# Altium schematic sheet Principal.SchDoc
size A4; Author: Thomas Kreppel; CompanyName: Universidad de Santiago de Chile; Address1: Avenida Ecuador Nº 3519; Address2: Estación Central, Santiago; Address3: Chile; DocumentNumber: 1; SheetNumber: 1; SheetTotal: 5
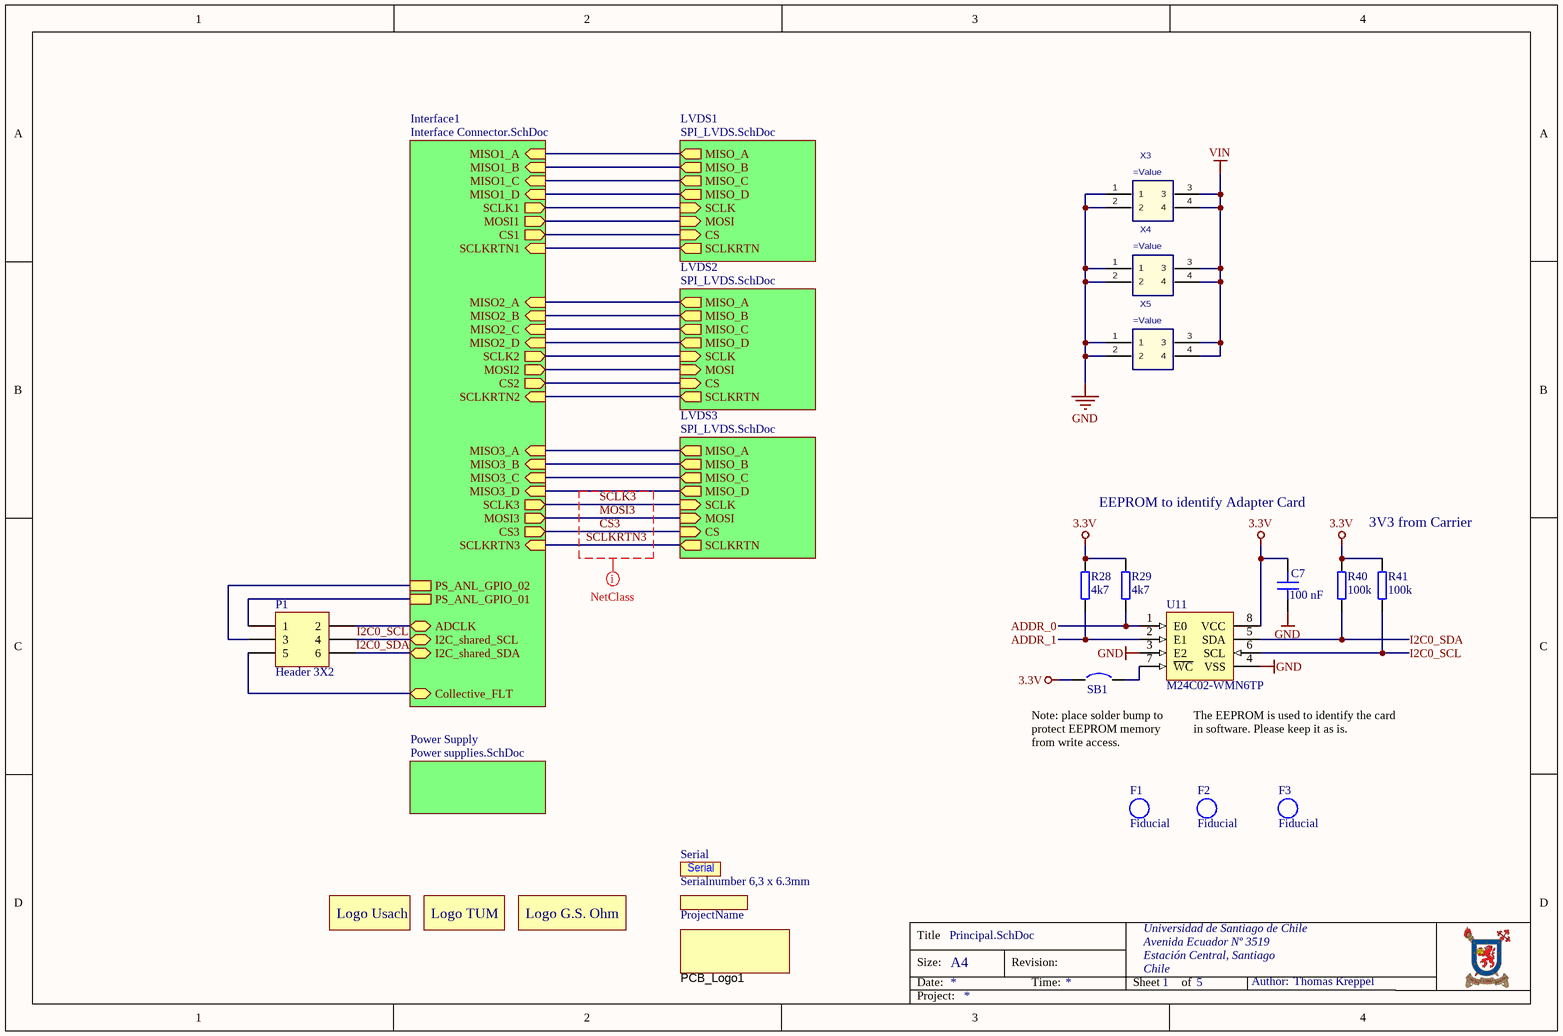
[diagram p0: Principal.SchDoc]

## Parts
C7  100 nF  [C_0603]
F1  Fiducial  [Fiducial_1.7mm]  (no BOM)
F2  Fiducial  [Fiducial_1.7mm]  (no BOM)
F3  Fiducial  [Fiducial_1.7mm]  (no BOM)
Logo1  LOGO USACH  [Logo Usach]  (value not drawn)  (no BOM)
Logo2  LOGO TUM  [Logo TUM]  (value not drawn)  (no BOM)
Logo3  LOGO G.S. Ohm  [Logo G.S.Ohm University]  (value not drawn)  (no BOM)
P1  Header 3X2  [HDR2X3]  (no BOM)
PCB_Logo1  ESD Susceptible  [ESD_Overlay_Medium]  (value not drawn)  (no BOM)
ProjectName  Project Name, Rev  [ID_ProjectRev]  (value not drawn)  (no BOM)
R28  4k7  [RES 0603_1608]
R29  4k7  [RES 0603_1608]
R40  100k  [RES 0603_1608]
R41  100k  [RES 0603_1608]
SB1  Solder Bump 0603  [SB_0603]  (value not drawn)  (no BOM)
Serial  Serialnumber 6,3 x 6.3mm  [Serial_6.3x6.3mm]  (no BOM)
U11  M24C02-WMN6TP  [D0008A_N]
X3  (no value)  [IPL1-102-01-L-D-K]
X4  (no value)  [IPL1-102-01-L-D-K]
X5  (no value)  [IPL1-102-01-L-D-K]

## Sub-sheets
Interface1 = Interface Connector.SchDoc: MISO2_B (in), MOSI3 (out), SCLK1 (out), MISO3_A (in), SCLK2 (out), CS1 (out), MISO1_A (in), MISO1_C (in), MISO2_C (in), PS_ANL_GPIO_02, MOSI1 (out), Collective_FLT (bidir), SCLKRTN2 (in), MOSI2 (out), SCLKRTN3 (in), MISO3_B (in), CS2 (out), SCLKRTN1 (in), ADCLK (bidir), MISO1_D (in), CS3 (out), MISO3_D (in), MISO3_C (in), MISO1_B (in), MISO2_A (in), MISO2_D (in), I2C_shared_SDA (bidir), PS_ANL_GPIO_01, SCLK3 (out), I2C_shared_SCL (bidir)
LVDS1 = SPI_LVDS.SchDoc: SCLKRTN (out), MOSI (in), MISO_C (out), MISO_A (out), MISO_D (out), MISO_B (out), SCLK (in), CS (in)
LVDS2 = SPI_LVDS.SchDoc: SCLKRTN (out), MOSI (in), MISO_C (out), MISO_A (out), MISO_D (out), MISO_B (out), SCLK (in), CS (in)
LVDS3 = SPI_LVDS.SchDoc: SCLKRTN (out), MOSI (in), MISO_C (out), MISO_A (out), MISO_D (out), MISO_B (out), SCLK (in), CS (in)
Power Supply = Power supplies.SchDoc: no entries

## Nets
3.3V: C7.1 R28.2 R29.2 R40.2 R41.2 SB1.1 U11.8(VCC)
GND: C7.2 U11.3(E2) U11.4(VSS) X3.1 X3.2 X4.1 X4.2 X5.1 X5.2
VIN: X3.3 X3.4 X4.3 X4.4 X5.3 X5.4
ADDR_0: R29.1 U11.1(E0)
ADDR_1: R28.1 U11.2(E1)
CS3: sheet Interface1/CS3, sheet LVDS3/CS
I2C0_SCL: P1.4 R41.1 U11.6(SCL) ; sheet Interface1/I2C_shared_SCL
I2C0_SDA: P1.6 R40.1 U11.5(SDA) ; sheet Interface1/I2C_shared_SDA
MOSI3: sheet Interface1/MOSI3, sheet LVDS3/MOSI
SCLK3: sheet Interface1/SCLK3, sheet LVDS3/SCLK
SCLKRTN3: sheet Interface1/SCLKRTN3, sheet LVDS3/SCLKRTN
NetP1_1: P1.1 ; sheet Interface1/PS_ANL_GPIO_01
NetP1_2: P1.2 ; sheet Interface1/ADCLK
NetP1_3: P1.3 ; sheet Interface1/PS_ANL_GPIO_02
NetP1_5: P1.5 ; sheet Interface1/Collective_FLT
NetSB1_2: SB1.2 U11.7(~{WC})
(unnamed): sheet Interface1/MISO2_B, sheet LVDS2/MISO_B
(unnamed): sheet Interface1/SCLK1, sheet LVDS1/SCLK
(unnamed): sheet Interface1/MISO3_A, sheet LVDS3/MISO_A
(unnamed): sheet Interface1/SCLK2, sheet LVDS2/SCLK
(unnamed): sheet Interface1/CS1, sheet LVDS1/CS
(unnamed): sheet Interface1/MISO1_A, sheet LVDS1/MISO_A
(unnamed): sheet Interface1/MISO1_C, sheet LVDS1/MISO_C
(unnamed): sheet Interface1/MISO2_C, sheet LVDS2/MISO_C
(unnamed): sheet Interface1/MOSI1, sheet LVDS1/MOSI
(unnamed): sheet Interface1/SCLKRTN2, sheet LVDS2/SCLKRTN
(unnamed): sheet Interface1/MOSI2, sheet LVDS2/MOSI
(unnamed): sheet Interface1/MISO3_B, sheet LVDS3/MISO_B
(unnamed): sheet Interface1/CS2, sheet LVDS2/CS
(unnamed): sheet Interface1/SCLKRTN1, sheet LVDS1/SCLKRTN
(unnamed): sheet Interface1/MISO1_D, sheet LVDS1/MISO_D
(unnamed): sheet Interface1/MISO3_D, sheet LVDS3/MISO_D
(unnamed): sheet Interface1/MISO3_C, sheet LVDS3/MISO_C
(unnamed): sheet Interface1/MISO1_B, sheet LVDS1/MISO_B
(unnamed): sheet Interface1/MISO2_A, sheet LVDS2/MISO_A
(unnamed): sheet Interface1/MISO2_D, sheet LVDS2/MISO_D

## Layout directives
net class SPI_C: CS3, MOSI3, SCLK3, SCLKRTN3

## Notes on the sheet
- EEPROM to identify Adapter Card
- 3V3 from Carrier
- Note: place solder bump to protect EEPROM memory from write access.
- (near U11) The EEPROM is used to identify the card in software. Please keep it as is.
- Title
- Size:
- Date:
- A4
- Revision:
- Time:
- Sheet
- of
- Author:
- Project:
- (in symbol LOGO G.S. Ohm) Logo G.S. Ohm
- (in symbol LOGO TUM) Logo TUM
- (in symbol LOGO USACH) Logo Usach

## Library data of the parts
C7 = C0603C104K9PACTU: Capacitor 0603, 6.3 VDC, 100 nF, X5R; Manufacturer: KEMET; Tolerance: 10 %; Voltage Rating: 6.3 VDC; Created from: MGremer; Manufacturer Part Number: C0603C104K9PACTU; PartID: 70; Created On: 20.12.2020 13:54:13; ComponentLink1Description: Datasheet; ComponentLink1URL: https://www.mouser.de/datasheet/2/212/KEM_C1006_X5R_SMD-1103249.pdf; Component Type: Capacitor 0603; Device Package: 0603; Last Updated: 20.01.2021 13:57:36; Mounting Type: SMD; Operating Temperature: -55 - 85°C; Series: SMD Comm X5R; Supplier 1: Mouser; Supplier Part Number 1: 80-C0603C104K9P; Type: Capacitor; Value: 100 nF; Live Cycle Status: 1; Stock number: not stored; LCSC Part Number: C14663
F1-F3 = Fiducial: Fiducial for Assembler
P1 = Header 3X2: Header, 3-Pin, Dual row; LatestRevisionDate: 17-Jul-2002; LatestRevisionNote: Re-released for DXP Platform.; Publisher: Altium Limited
PCB_Logo1 = LOGO_ESD_Susceptible: ESD Susceptible Symbol; Created: 2018_11_25_AGeiger; Value: ESD Susceptible
ProjectName = ID_ProjectRev: Project Name and Revision Number; Created: 2018_11_23_AGeiger; Value: Project Name, Rev
R28 R29 = 0603WAF4701T5E: SMD resistor E24 series; Manufacturer: UNI-ROYAL; Tolerance: 1%; Created from: AGeiger; Manufacturer Part Number: 0603WAF4701T5E; PartID: 90; Created On: 14.12.2020 16:17:14; ComponentLink1Description: Datasheet; ComponentLink1URL: https://datasheet.lcsc.com/lcsc/2206010116_UNI-ROYAL-Uniroyal-Elec-0603WAF4701T5E_C23162.pdf; Component Type: SMD resistor; Device Package: 0603; Last Updated: 25.08.2022 20:03:04; Mounting Type: SMD; Supplier 1: LCSC; Supplier Part Number 1: C23162; Type: Resistor; Value: 4k7; Live Cycle Status: 1; Stock number: Labor SMD Container; LCSC Part Number: C23162
R40 R41 = RK73B1JTTD104J: SMD resistor E24 series; Manufacturer: KOA Speer; Tolerance: 5%; Created from: MGremer; Manufacturer Part Number: RK73B1JTTD104J; PartID: 122; Created On: 14.12.2020 16:17:14; ComponentLink1Description: Datasheet; ComponentLink1URL: https://www.mouser.de/datasheet/2/219/RK73B-1825463.pdf; Component Type: SMD resistor; Device Package: 0603; Last Updated: 27.05.2022 14:04:10; Mounting Type: SMD; Supplier 1: Mouser; Supplier Part Number 1: 660-RK73B1JTTD104J; Type: Resistor; Value: 100k; Live Cycle Status: 1; Stock number: Labor SMD Container; LCSC Part Number: C25803
SB1 = =Value: Created from: AGeiger; Revision: July-2002: Re-released for DXP Platform.; PartID: 1; Created On: 09.01.2024 17:13:56; Component Type: Solder Bump; Device Package: 0603; Last Updated: 09.01.2024 17:13:56; Manufacturer Part Number: Solder Bump 0603; Mounting Type: SMD; Value: Solder Bump 0603
Serial = SerialNumber: Created: 2018_09_18_AGeiger; Value: Serialnumber 6,3 x 6.3mm
U11 = M24C02-WMN6TP: 2Kbit I2C SOP-8 EEPROM ROHS; Manufacturer: STMicroelectronics; Created from: AGeiger; Manufacturer Part Number: M24C02-WMN6TP; PartID: 1; Created On: 19.11.2023 14:54:27; ComponentLink1Description: Datasheet; ComponentLink1URL: https://www.st.com/resource/en/datasheet/m24c01-w.pdf; Component Type: EEPROM; Device Package: SOIC-8; Last Updated: 19.11.2023 21:39:04; Mounting Type: SMD; Operating Temperature: -40 to +85 °C; Series: M24xxx; Supplier 1: Mouser; Supplier Part Number 1: 511-M24C02-WMN6TP; Supplier 2: LCSC; Supplier Part Number 2: C7562; Type: Memory; Value: M24C02-WMN6TP; LCSC Part Number: C7562
X3-X5 = IPL1-102-XX-X-D-X: 2.54mm Double Row Terminal Assembly, Right-Angled; MF: SAMTEC; Created: 2018_05_02_AGeiger; Value: =MPN; MPN: IPL1-102-01-L-D-K; Supplier 1: Digikey; Supplier Part Number 1: SAM10565-ND